# Altium project MoP projekt RC.PrjPCB
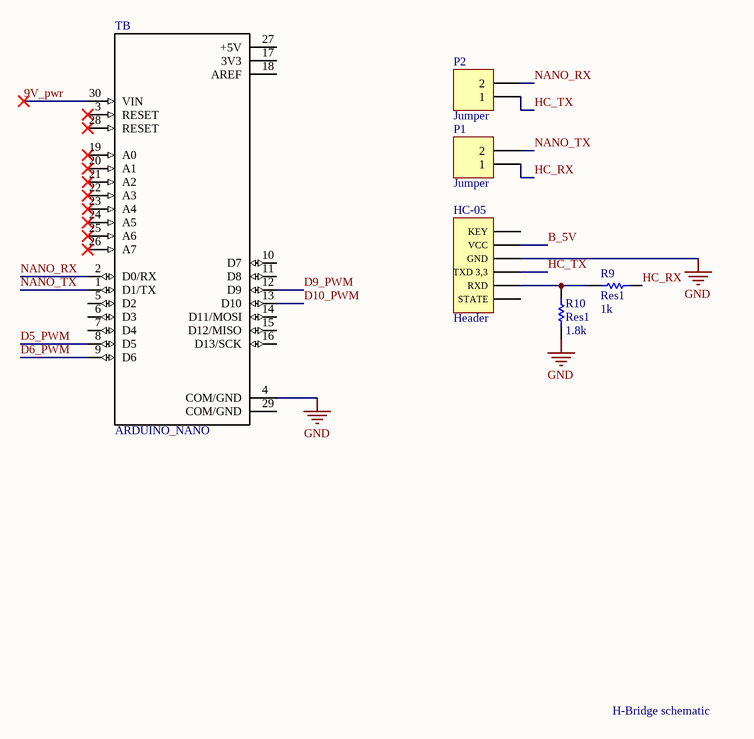
[diagram p0: RC Brain Sch.SchDoc]
4 sheets, 35 parts. Net scope: global (net labels, ports and power ports of the same name join across sheets).
Board file: RC PCB v2.PcbDoc
Sheets:
  RC Brain Sch.SchDoc
  Buck_Converter Sch.SchDoc
  H-Bridge drive Sch.SchDoc
  H-Bridge turning Sch.SchDoc

## Sheet RC Brain Sch.SchDoc
size A4; Author: Alexander Riex; DrawnBy: Alexander Riex; Engineer: Alexander Riex

### Parts
HC-05  Header  [HDR1X6]
P1  Jumper  [HDR1X2]
P2  Jumper  [HDR1X2]
R9  Res1  value 1k  [6-0805_N]
R10  Res1  value 1.8k  [6-0805_N]
TB  ARDUINO_NANO  [*SHIELD_ARDUINO_NANO]

### Nets
GND: HC-05.3(GND) R10.1 TB.4(COM/GND)
9V_pwr: TB.30(VIN)
B_5V: HC-05.2(VCC)
D5_PWM: TB.8(D5)
D6_PWM: TB.9(D6)
D9_PWM: TB.12(D9)
D10_PWM: TB.13(D10)
HC_RX: P1.1 R9.2
HC_TX: HC-05.4(TXD_3,3) P2.1
NANO_RX: P2.2 TB.2(D0/RX)
NANO_TX: P1.2 TB.1(D1/TX)
NetHC-05_5: HC-05.5(RXD) R9.1 R10.2

Not connected (* = marked no-connect by the designer): HC-05 1(KEY) 6(STATE); TB 3(RESET)* 5(D2) 6(D3) 7(D4) 10(D7) 11(D8) 14(D11/MOSI) 15(D12/MISO) 16(D13/SCK) 17(3V3) 18(AREF) 19(A0)* 20(A1)* 21(A2)* 22(A3)* 23(A4)* 24(A5)* 25(A6)* 26(A7)* 27(+5V) 28(RESET)* 29(COM/GND)

### Notes on the sheet
- H-Bridge schematic

### Library data of the parts
HC-05 = Header 6: Header, 6-Pin; LatestRevisionDate: 17-Jul-2002; LatestRevisionNote: Re-released for DXP Platform.; Publisher: Altium Limited
P1 P2 = Header 2: Header, 2-Pin; LatestRevisionDate: 17-Jul-2002; LatestRevisionNote: Re-released for DXP Platform.; Publisher: Altium Limited
R9 R10 = Res1: Resistor; Published: 8-Jun-2000; LatestRevisionDate: 17-Jul-2002; LatestRevisionNote: Re-released for DXP Platform.; PackageReference: AXIAL-0.3; Publisher: Altium Limited; PackageDescription: Axial Device, Thru-Hole; 2 Leads; 0.3 in Pin Spacing
TB = ARDUINO_NANO: ATmega328 Arduino Nano AVRÂ® ATmega AVR MCU 8-Bit Embedded Evaluation Board; MF: Arduino; SnapEDA_Link: https://www.snapeda.com/parts/ARDUINO%20NANO/Arduino/view-part/1128261/?ref=snap; Price: None; Availability: Unavailable; MP: ARDUINO NANO; Package: None; Value: *

## Sheet Buck_Converter Sch.SchDoc
size A4
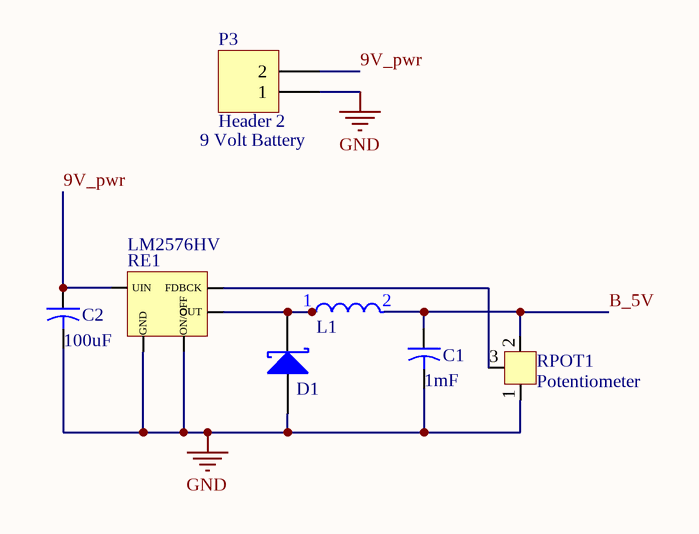
[diagram p1: Buck_Converter Sch.SchDoc]

### Parts
C1  value 1mF  [CAPR5-4X5]  (hidden comment: Cap2)
C2  value 100uF  [CAPR5-4X5]  (hidden comment: Cap2)
D1  Diode 11DQ03  [DO-204AL]  (value not drawn)
L1  Inductor SMD 100 uH  [Inductor 100uH]  (value not drawn)
P3  Header 2  [HDR1X2]
RE1  LM2576HV  [LM2576]
RPOT1  Potentiometer  [Potentiometer 10k]

### Nets
GND: C1.2 C2.2 D1.1(A) P3.1 RE1.3(GND) RE1.5(ON/OFF) RPOT1.1
9V_pwr: C2.1 P3.2 RE1.1(UIN)
B_5V: C1.1 L1.2 RPOT1.2
NetD1_2: D1.2(K) L1.1 RE1.2(OUT)
NetRE1_4: RE1.4(FDBCK) RPOT1.3

### Notes on the sheet
- (near P3) 9 Volt Battery

### Library data of the parts
C1 C2 = Cap2: Capacitor; Published: 23-Sep-2002; PackageReference: CAPR5-4X5; Publisher: Altium Limited; PackageDescription: Capacitor; 2 Leads
D1 = Diode 11DQ03: Schottky Rectifier; Published: 8-Jun-2000; LatestRevisionDate: 17-Jul-2002; LatestRevisionNote: Re-released for DXP Platform.; DatasheetVersion: Dec-1997; PackageReference: DO-204AL; Publisher: Altium Limited; PackageDescription: Diode, Axial; Body 5.2 x 2.7 mm (LxDia. max), Lead Dia. 0.86 mm (max); Code_JEDEC: DO-204-AL; ComponentLink1Description: Manufacturer Link; ComponentLink1URL: http://www.irf.com/; ComponentLink2Description: Datasheet; ComponentLink2URL: http://www.irf.com/product-info/datasheets/data/11dq03.pdf
P3 = Header 2: Header, 2-Pin; LatestRevisionDate: 17-Jul-2002; LatestRevisionNote: Re-released for DXP Platform.; Publisher: Altium Limited
RPOT1 = Potentiometer: potentiometer 10k

## Sheet H-Bridge drive Sch.SchDoc
size A4
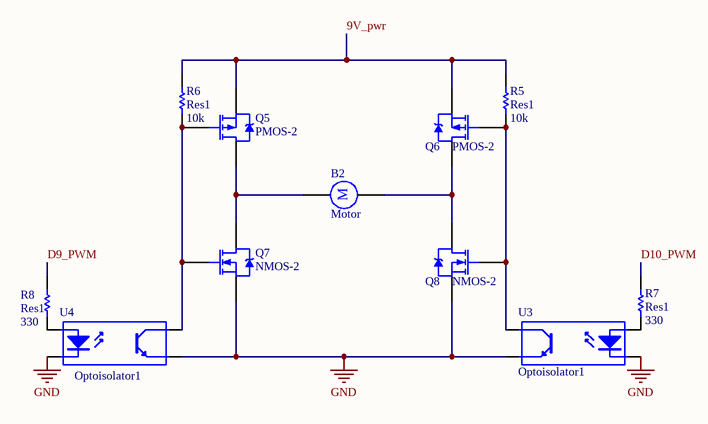
[diagram p2: H-Bridge drive Sch.SchDoc]

### Parts
B2  Motor  [HDR1X2]
Q5  PMOS-2  [TO-220AB]
Q6  PMOS-2  [TO-220AB]
Q7  NMOS-2  [TO-220AB]
Q8  NMOS-2  [TO-220AB]
R5  Res1  value 10k  [6-0805_N]
R6  Res1  value 10k  [6-0805_N]
R7  Res1  value 330  [6-0805_N]
R8  Res1  value 330  [6-0805_N]
U3  Optoisolator1  [DIP-4]
U4  Optoisolator1  [DIP-4]

### Nets
GND: Q7.3(S) Q8.3(S) U3.2(K) U3.3(E) U4.2(K) U4.3(E)
9V_pwr: Q5.3(S) Q6.3(S) R5.2 R6.2
D9_PWM: R8.2
D10_PWM: R7.2
NetB2_1: B2.1 Q5.2(D) Q7.2(D)
NetB2_2: B2.2 Q6.2(D) Q8.2(D)
NetQ5_1: Q5.1(G) Q7.1(G) R6.1 U4.4(C)
NetQ6_1: Q6.1(G) Q8.1(G) R5.1 U3.4(C)
NetR7_1: R7.1 U3.1(A)
NetR8_1: R8.1 U4.1(A)

### Notes on the sheet
- (in symbol Motor) M

### Library data of the parts
B2 = Motor: Motor, General Kind; Published: 24-Mar-1999; LatestRevisionDate: 17-Jul-2002; LatestRevisionNote: Re-released for DXP Platform.; PackageReference: RB5-10.5; Publisher: Altium Limited; PackageDescription: Capacitor (Radial); 2 Leads
Q5 Q6 = PMOS-2: P-Channel Power MOSFET; Note: Pin 4 not drawn and electrically connected to Pin 2.; Published: 8-Jun-2000; LatestRevisionDate: 17-Jul-2002; LatestRevisionNote: Re-released for DXP Platform.; DatasheetVersion: PD-9.390D; PackageVersion: Feb-1997; PackageReference: TO-220AB; Publisher: Altium Limited; PackageDescription: TO, Thru-Hole, Vertical, Heatsink Mounted; 3 In-Line Leads; Pitch 2.54 mm; ComponentLink1Description: Manufacturer Link; ComponentLink1URL: http://www.irf.com/
Q7 Q8 = NMOS-2: N-Channel Power MOSFET; Note: Pin 2 is electrically connected to pin 4.; Published: 8-Jun-2000; LatestRevisionDate: 17-Jul-2002; LatestRevisionNote: Re-released for DXP Platform.; DatasheetVersion: PD-9.814; PackageVersion: Feb-1997; PackageReference: TO-220AB; Publisher: Altium Limited; PackageDescription: TO, Thru-Hole, Vertical, Heatsink Mounted; 3 In-Line Leads; Pitch 2.54 mm; ComponentLink1Description: Manufacturer Link; ComponentLink1URL: http://www.irf.com/
R5-R8 = Res1: Resistor; Published: 8-Jun-2000; LatestRevisionDate: 17-Jul-2002; LatestRevisionNote: Re-released for DXP Platform.; PackageReference: AXIAL-0.3; Publisher: Altium Limited; PackageDescription: Axial Device, Thru-Hole; 2 Leads; 0.3 in Pin Spacing
U3 U4 = Optoisolator1: 4-Pin Phototransistor Optocoupler; Published: 24-Mar-1999; LatestRevisionDate: 04-Mar-2005; LatestRevisionNote: Sch pins 3 & 4 Swapped.; DatasheetVersion: Nov-2003; PackageReference: DIP-4; Publisher: Altium Limited

## Sheet H-Bridge turning Sch.SchDoc
size A4
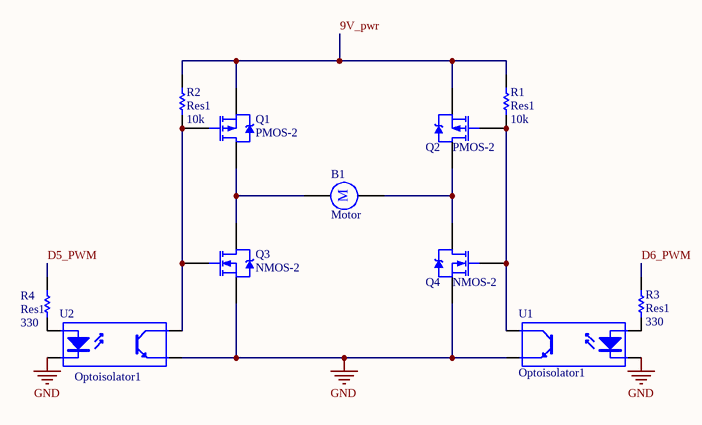
[diagram p3: H-Bridge turning Sch.SchDoc]

### Parts
B1  Motor  [HDR1X2]
Q1  PMOS-2  [TO-220AB]
Q2  PMOS-2  [TO-220AB]
Q3  NMOS-2  [TO-220AB]
Q4  NMOS-2  [TO-220AB]
R1  Res1  value 10k  [6-0805_N]
R2  Res1  value 10k  [6-0805_N]
R3  Res1  value 330  [6-0805_N]
R4  Res1  value 330  [6-0805_N]
U1  Optoisolator1  [DIP-4]
U2  Optoisolator1  [DIP-4]

### Nets
GND: Q3.3(S) Q4.3(S) U1.2(K) U1.3(E) U2.2(K) U2.3(E)
9V_pwr: Q1.3(S) Q2.3(S) R1.2 R2.2
D5_PWM: R4.2
D6_PWM: R3.2
NetB1_1: B1.1 Q1.2(D) Q3.2(D)
NetB1_2: B1.2 Q2.2(D) Q4.2(D)
NetQ1_1: Q1.1(G) Q3.1(G) R2.1 U2.4(C)
NetQ2_1: Q2.1(G) Q4.1(G) R1.1 U1.4(C)
NetR3_1: R3.1 U1.1(A)
NetR4_1: R4.1 U2.1(A)

### Notes on the sheet
- (in symbol Motor) M

### Library data of the parts
B1 = Motor: Motor, General Kind; Published: 24-Mar-1999; LatestRevisionDate: 17-Jul-2002; LatestRevisionNote: Re-released for DXP Platform.; PackageReference: RB5-10.5; Publisher: Altium Limited; PackageDescription: Capacitor (Radial); 2 Leads
Q1 Q2 = PMOS-2: as Q5 on sheet H-Bridge drive Sch; Published: 8-Jun-2000; LatestRevisionDate: 17-Jul-2002; LatestRevisionNote: Re-released for DXP Platform.; DatasheetVersion: PD-9.390D; PackageVersion: Feb-1997; PackageReference: TO-220AB; Publisher: Altium Limited; PackageDescription: TO, Thru-Hole, Vertical, Heatsink Mounted; 3 In-Line Leads; Pitch 2.54 mm; ComponentLink1Description: Manufacturer Link; ComponentLink1URL: http://www.irf.com/
Q3 Q4 = NMOS-2: as Q7 on sheet H-Bridge drive Sch; Published: 8-Jun-2000; LatestRevisionDate: 17-Jul-2002; LatestRevisionNote: Re-released for DXP Platform.; DatasheetVersion: PD-9.814; PackageVersion: Feb-1997; PackageReference: TO-220AB; Publisher: Altium Limited; PackageDescription: TO, Thru-Hole, Vertical, Heatsink Mounted; 3 In-Line Leads; Pitch 2.54 mm; ComponentLink1Description: Manufacturer Link; ComponentLink1URL: http://www.irf.com/
R1-R4 = Res1: Resistor; Published: 8-Jun-2000; LatestRevisionDate: 17-Jul-2002; LatestRevisionNote: Re-released for DXP Platform.; PackageReference: AXIAL-0.3; Publisher: Altium Limited; PackageDescription: Axial Device, Thru-Hole; 2 Leads; 0.3 in Pin Spacing
U1 U2 = Optoisolator1: 4-Pin Phototransistor Optocoupler; Published: 24-Mar-1999; LatestRevisionDate: 04-Mar-2005; LatestRevisionNote: Sch pins 3 & 4 Swapped.; DatasheetVersion: Nov-2003; PackageReference: DIP-4; Publisher: Altium Limited

## Nets that join several sheets
GND: RC Brain Sch (HC-05.3 R10.1 TB.4), Buck_Converter Sch (7 pins), H-Bridge drive Sch (6 pins), H-Bridge turning Sch (6 pins)
9V_pwr: RC Brain Sch (TB.30), Buck_Converter Sch (C2.1 P3.2 RE1.1), H-Bridge drive Sch (Q5.3 Q6.3 R5.2 R6.2), H-Bridge turning Sch (Q1.3 Q2.3 R1.2 R2.2)
B_5V: RC Brain Sch (HC-05.2), Buck_Converter Sch (C1.1 L1.2 RPOT1.2)
D5_PWM: RC Brain Sch (TB.8), H-Bridge turning Sch (R4.2)
D6_PWM: RC Brain Sch (TB.9), H-Bridge turning Sch (R3.2)
D9_PWM: RC Brain Sch (TB.12), H-Bridge drive Sch (R8.2)
D10_PWM: RC Brain Sch (TB.13), H-Bridge drive Sch (R7.2)